# EAGLE design soil_moisture_meter (EAGLE 6.4)
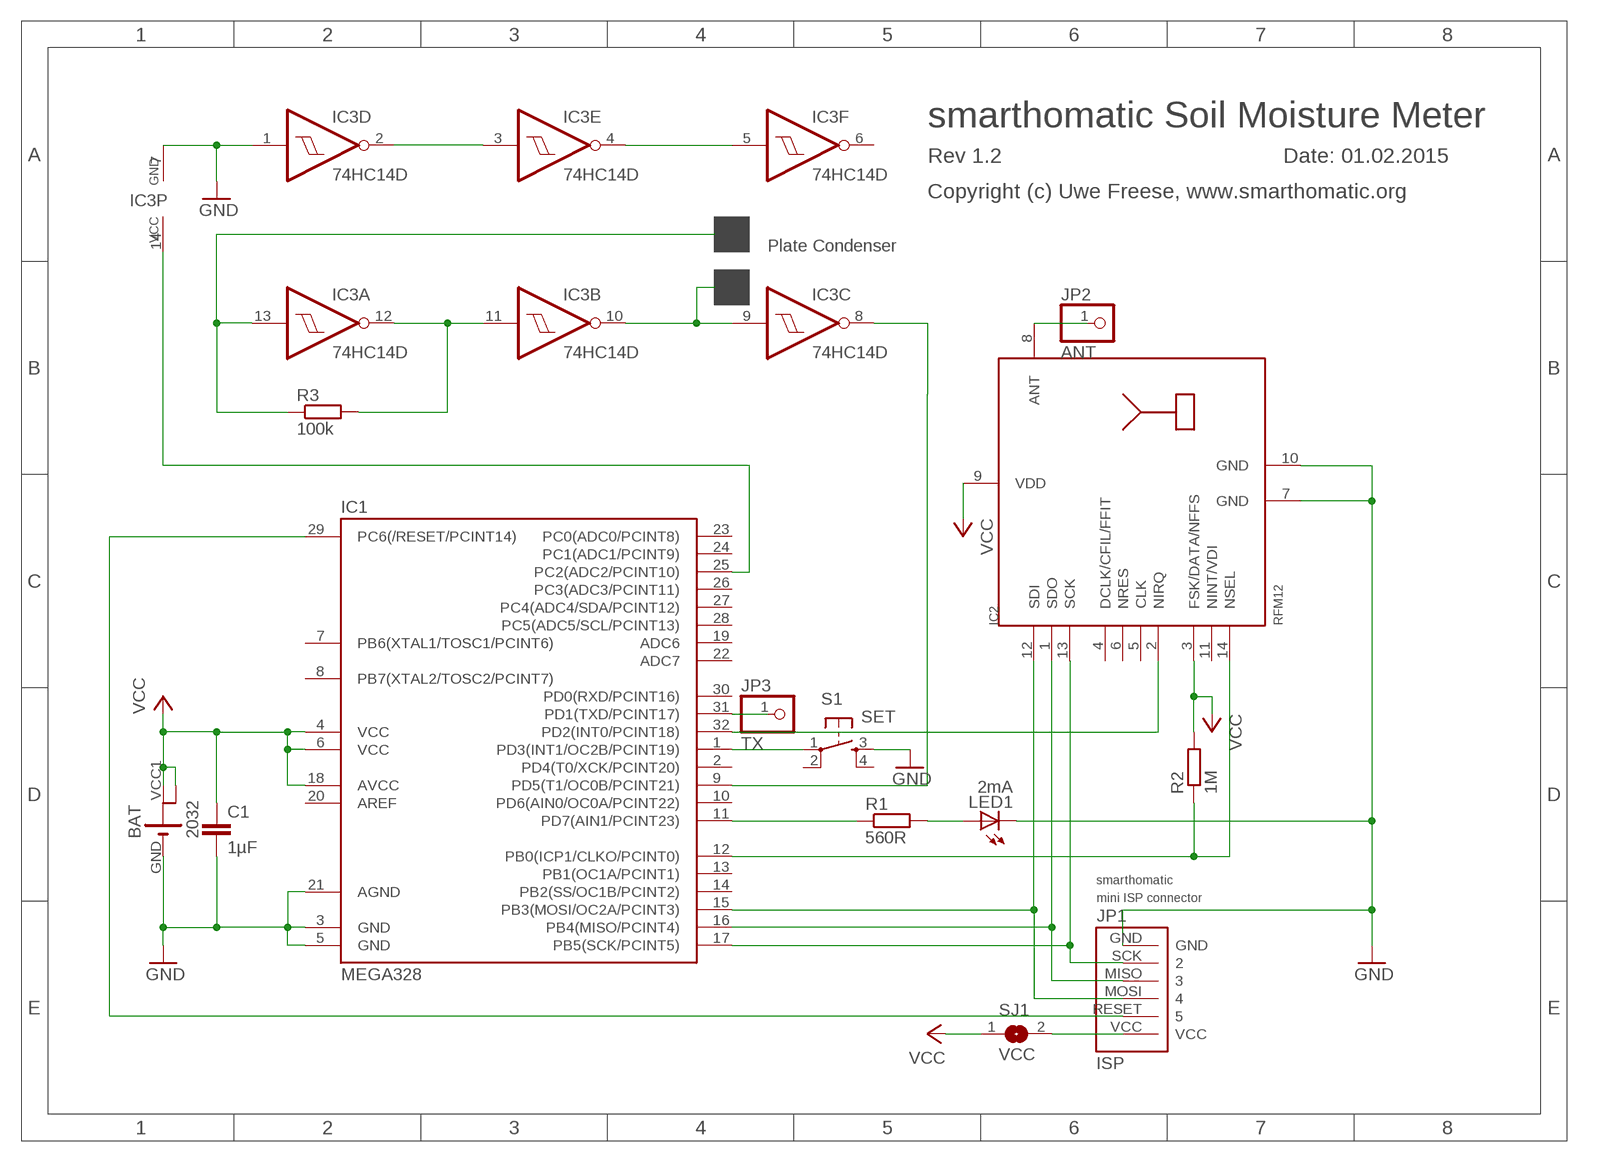
[diagram p0: schematic, sheet 1]

## Parts
BAT  2032  [KZH20SMD]
C1  1µF  C-EUC0603  [C0603]
IC1  MEGA328  MEGA48/88/168-AU  [TQFP32-08]
IC2  RFM12  [RFM]
IC3  74HC14D  [SO14]
JP1  ISP  SHC_MINI_ISPP  [PINHD_1X6_1.27]
JP2  ANT  PINHD-1X1  [1X01]
JP3  TX  PINHD-1X1  [1X01]
LED1  2mA  LED3MM  [LED3MM]
R1  560R  R-EU_R0603  [R0603]
R2  1M  R-EU_R0603  [R0603]
R3  100k  R-EU_R0603  [R0603]
S1  SET  LSG  [SCHURTER_LSG]
SJ1  VCC  SJ  [SJ]

## Nets
GND: BAT.GND C1.2 IC1.3(GND) IC1.5(GND) IC1.21(AGND) IC2.7(GND) IC2.10(GND) IC3.1(D:I) IC3.7(P:GND) JP1.GND LED1.K(C) S1.3(S)
N$1: JP1.VCC SJ1.2
N$2: IC3.11(B:I) IC3.12(A:O) R3.2
N$3: IC1.15(PB3(MOSI/OC2A/PCINT3)) IC2.12(SDI) JP1.MOSI
N$4: IC1.16(PB4(MISO/PCINT4)) IC2.1(SDO) JP1.MISO
N$5: IC1.17(PB5(SCK/PCINT5)) IC2.13(SCK) JP1.SCK
N$6: IC1.11(PD7(AIN1/PCINT23)) R1.1
N$7: IC3.9(C:I) IC3.10(B:O)
N$8: IC1.29(PC6(/RESET/PCINT14)) JP1.RESET
N$9: IC3.13(A:I) R3.1
N$10: IC1.9(PD5(T1/OC0B/PCINT21)) IC3.8(C:O)
N$12: LED1.A R1.2
N$13: IC1.12(PB0(ICP1/CLKO/PCINT0)) IC2.14(NSEL) R2.1
N$15: IC1.32(PD2(INT0/PCINT18)) IC2.2(NIRQ)
N$16: IC2.8(ANT) JP2.1
N$17: IC3.4(E:O) IC3.5(F:I)
N$18: IC3.2(D:O) IC3.3(E:I)
N$19: IC1.1(PD3(INT1/OC2B/PCINT19)) S1.1(P)
N$20: IC1.25(PC2(ADC2/PCINT10)) IC3.14(P:VCC)
N$21: IC1.31(PD1(TXD/PCINT17)) JP3.1
VCC: BAT.VCC1 BAT.VCC2 C1.1 IC1.4(VCC) IC1.6(VCC) IC1.18(AVCC) IC2.3(FSK/DATA/NFFS) IC2.9(VDD) R2.2 SJ1.1
Unconnected: IC1.2(PD4(T0/XCK/PCINT20)) IC1.7(PB6(XTAL1/TOSC1/PCINT6)) IC1.8(PB7(XTAL2/TOSC2/PCINT7)) IC1.10(PD6(AIN0/OC0A/PCINT22)) IC1.13(PB1(OC1A/PCINT1)) IC1.14(PB2(SS/OC1B/PCINT2)) IC1.19(ADC6) IC1.20(AREF) IC1.22(ADC7) IC1.23(PC0(ADC0/PCINT8)) IC1.24(PC1(ADC1/PCINT9)) IC1.26(PC3(ADC3/PCINT11)) IC1.27(PC4(ADC4/SDA/PCINT12)) IC1.28(PC5(ADC5/SCL/PCINT13)) IC1.30(PD0(RXD/PCINT16)) IC2.4(DCLK/CFIL/FFIT) IC2.5(CLK) IC2.6(NRES) IC2.11(NINT/VDI) IC3.6(F:O) S1.2(P1) S1.4(S1)

## Notes on the sheet
- smarthomatic Soil Moisture Meter
- Rev 1.2 | Date: 01.02.2015
- Copyright (c) Uwe Freese, www.smarthomatic.org
- Plate Condenser

## Library data of the parts
BAT = battery_holder_2032:2032
C1 = resistor:C-EU: CAPACITOR, European symbol
IC1 = avr-5-4.16:MEGA48/88/168
IC2 = hopeRF:RFM12
IC3 = 74xx-eu:74*14: Hex schmitt trigger INVERTER
JP1 = shc_mini_isp:SHC_MINI_ISP: smarthomatic mini ISP connector, 1.27mm grid
JP2 JP3 = pinhead:PINHD-1X1: PIN HEADER
LED1 = led:LED: LED OSRAM: - CHIPLED LG R971, LG N971, LY N971, LG Q971, LY Q971, LO R971, LY R971 LH N974, LH R974 LS Q976, LO Q976, LY Q976 LO Q996 - Hyper CHIPLED LW Q18S LB Q993, LB Q99A, LB R99A - SideLED LS A670, LO A670, LY A670, LG A670, LP A670 LB A673, LV A673, LT A673, LW A673 LH A674 LY A675 LS A676, LA A676, LO A676, LY A676, LW A676 LS A679, LY A679, LG A679 - Hyper Micro SIDELED® LS Y876, LA Y876, LO Y876, LY Y876 LT Y87S - SmartLED LW L88C, LW L88S LB L89C, LB L89S, LG L890 LS L89K, LO L89K, LY L89K LS L896, LA L896, LO L896, LY L896 - TOPLED LS T670, LO T670, LY T670, LG T670, LP T670 LSG T670, LSP T670, LSY T670, LOP T670, LYG T670 LG T671, LOG T671, LSG T671 LB T673, LV T673, LT T673, LW T673 LH T674 LS T676, LA T676, LO T676, LY T676, LB T676, LH T676, LSB T676, LW T676 LB T67C, LV T67C, LT T67C, LS T67K, LO T67K, LY T67K, LW E67C LS E67B, LA E67B, LO E67B, LY E67B, LB E67C, LV E67C, LT E67C LW T67C LS T679, LY T679, LG T679 LS T770, LO T770, LY T770, LG T770, LP T770 LB T773, LV T773, LT T773, LW T773 LH T774 LS E675, LA E675, LY E675, LS T675 LS T776, LA T776, LO T776, LY T776, LB T776 LHGB T686 LT T68C, LB T68C - Hyper Mini TOPLED® LB M676 - Mini TOPLED Santana® LG M470 LS M47K, LO M47K, LY M47K Source: http://www.osram.convergy.de LUXEON: - LUMILED® LXK2-PW12-R00, LXK2-PW12-S00, LXK2-PW14-U00, LXK2-PW14-V00 LXK2-PM12-R00, LXK2-PM12-S00, LXK2-PM14-U00 LXK2-PE12-Q00, LXK2-PE12-R00, LXK2-PE12-S00, LXK2-PE14-T00, LXK2-PE14-U00 LXK2-PB12-K00, LXK2-PB12-L00, LXK2-PB12-M00, LXK2-PB14-N00, LXK2-PB14-P00, LXK2-PB14-Q00 LXK2-PR12-L00, LXK2-PR12-M00, LXK2-PR14-Q00, LXK2-PR14-R00 LXK2-PD12-Q00, LXK2-PD12-R00, LXK2-PD12-S00 LXK2-PH12-R00, LXK2-PH12-S00 LXK2-PL12-P00, LXK2-PL12-Q00, LXK2-PL12-R00 Source: www.luxeon.com KINGBRIGHT: KA-3528ASYC Source: www.kingbright.com
R1-R3 = rcl:R-EU_: RESISTOR, European symbol
S1 = switch-omron-smd:LSG
SJ1 = jumper:SJ: SMD solder JUMPER

## Board
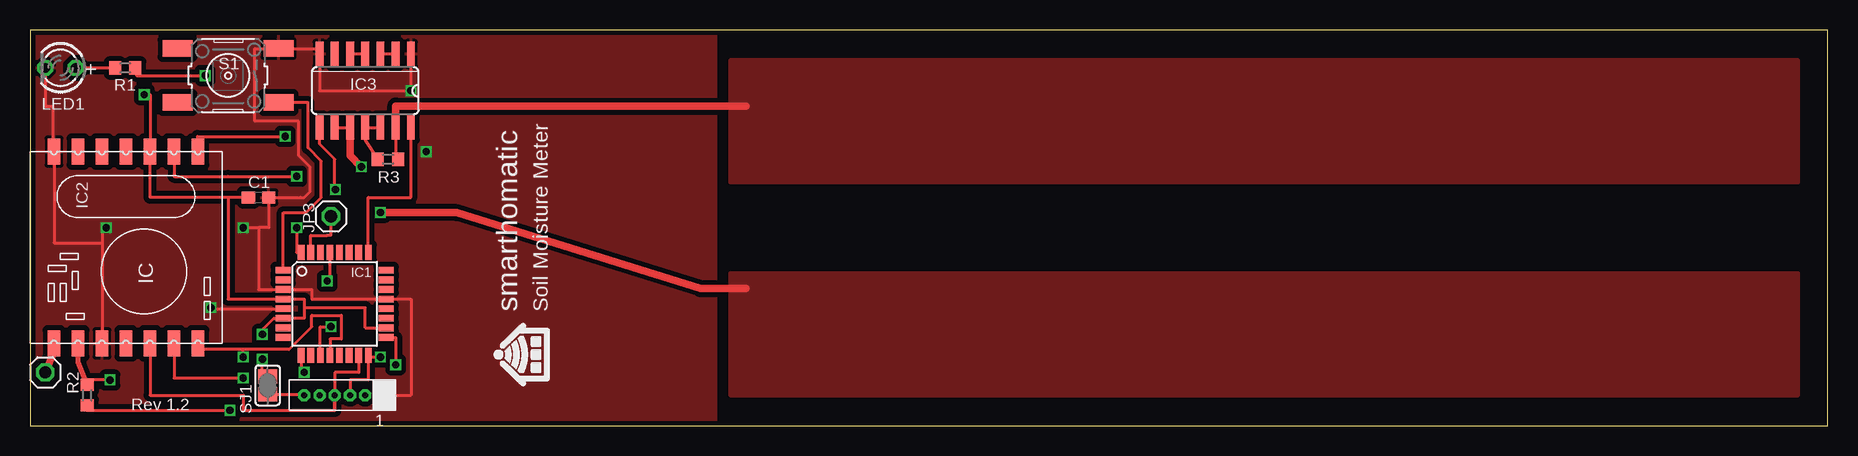
[diagram p1: board, top side]
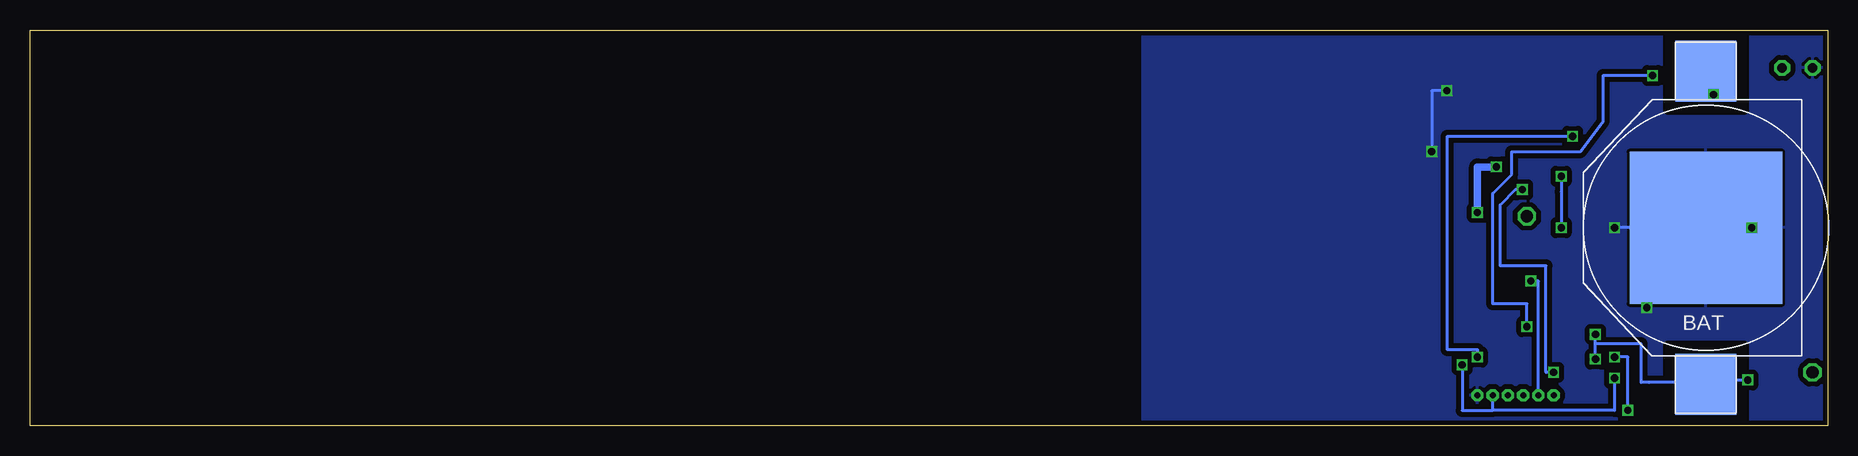
[diagram p2: board, bottom side, seen from below]

Size 149.86 x 33.01 mm. Coordinates in mm from the lower left corner, seen from the top.
Outline: 0,0 149.86,0 149.86,33.01 0,33.01 0,0
Copper layers (1*16): Top 0.035mm / dielectric 1.5mm / Bottom 0.035mm
Design rules "SeeedStudio_2layer_DRU_no_angle_20140221": minimum track width 6mil, minimum drill 12mil, track to track 6mil, track to pad 6mil, pad to pad 6mil, via to via 6mil, smd to smd 0mil, copper to edge 10mil, drill to drill 10mil, minimum pad ring 10mil, minimum via ring 6mil, stop-mask expansion 2mil, vias tented up to drill 100mil, thermal gap 10mil

### Footprints (pad centres in the part's own frame; a part is rotated, then mirrored left to right if it is on the bottom)
KZH20SMD = smd 12.7 x 12.7: GND 0,0 | smd 5.08 x 5.08: VCC1 -13.062,0; VCC2 13.062,0
C0603 = smd 1.1 x 1: 1 -0.85,0; 2 0.85,0
TQFP32-08 = smd 1.27 x 0.559: 1 -4.293,2.8; 2 -4.293,2; 3 -4.293,1.2; 4 -4.293,0.4; 5 -4.293,-0.4; 6 -4.293,-1.2; 7 -4.293,-2; 8 -4.293,-2.8; 17 4.293,-2.8; 18 4.293,-2; 19 4.293,-1.2; 20 4.293,-0.4; 21 4.293,0.4; 22 4.293,1.2; 23 4.293,2; 24 4.293,2.8 | smd 0.559 x 1.27: 9 -2.8,-4.293; 10 -2,-4.293; 11 -1.2,-4.293; 12 -0.4,-4.293; 13 0.4,-4.293; 14 1.2,-4.293; 15 2,-4.293; 16 2.8,-4.293; 25 2.8,4.293; 26 2,4.293; 27 1.2,4.293; 28 0.4,4.293; 29 -0.4,4.293; 30 -1.2,4.293; 31 -2,4.293; 32 -2.8,4.293
RFM = smd 2.184 x 1.067: 1 0,14; 2 0,12; 3 0,10; 4 0,8; 5 0,6; 6 0,4; 7 0,2; 8 16,2; 9 16,4; 10 16,6; 11 16,8; 12 16,10; 13 16,12; 14 16,14
SO14 = smd 0.66 x 2.032: 1 -3.81,-3.073; 2 -2.54,-3.073; 3 -1.27,-3.073; 4 0,-3.073; 5 1.27,-3.073; 6 2.54,-3.073; 7 3.81,-3.073; 8 3.81,3.073; 9 2.54,3.073; 10 1.27,3.073; 11 0,3.073; 12 -1.27,3.073; 13 -2.54,3.073; 14 -3.81,3.073
PINHD_1X6_1.27 = drill 0.5 octagon: GND 0,-2.54; MISO 0,0; MOSI 0,1.27; RESET 0,2.54; SCK 0,-1.27; VCC 0,3.81
1X01 = drill 1.016 octagon: 1 0,0
LED3MM = drill 0.813 octagon: A -1.27,0; K 1.27,0
R0603 = smd 1 x 1.1: 1 -0.85,0; 2 0.85,0
SCHURTER_LSG = smd 2.5 x 1.4: 1 -4.2,2.25; 2 4.2,2.25; 3 -4.2,-2.25; 4 4.2,-2.25
SJ = smd 1.168 x 1.6: 1 -0.762,0; 2 0.762,0

### Placement (x,y rotation side)
BAT  10.16,16.51 90 bottom
C1  19.05,19.05 0 top
IC1  25.4,10.16 0 top
IC2  0,22.86 270 top
IC3  27.94,27.94 180 top
JP1  26.67,2.54 90 top
JP2  1.27,4.45 0 top
JP3  25.08,17.46 0 top
LED1  2.54,29.84 180 top
R1  7.94,29.84 180 top
R2  4.76,2.54 90 top
R3  29.84,22.23 180 top
S1  16.51,29.21 180 top
SJ1  19.81,3.36 270 top

### Tracks (layer width: path | path; a pad name or v marks a point on that pad's centre or on a via)
GND  (via drill 0.6, 0.6 pad 0.61)
  Top 0.254: LED1.K 1.27,26.67 1.91,26.67 1.91,24.13 IC2.7 2,15.24 6,15.24 | IC1.21 23.5,10.56 23.5,11.36 IC1.3 19.05,11.36 19.05,16.51 | IC1.21 29.69,10.58 | JP1.GND 31.75,2.54 31.75,10.56 IC1.21 | IC3.1 v31.75,27.94 24.13,27.94 IC3.7 24.13,31.46 S1.3 18.73,31.46 18.73,25.4 22.38,25.4 22.38,22.54 23.34,21.59 23.34,21.43 23.34,19.53 22.86,19.05 22.54,19.05 C1.2 19.9,16.51 19.05,16.51 | 6,15.24 IC2.10 | v6.35,16.51 6,16.51 6,15.24 | v17.78,16.51 19.05,16.51 | v15.08,9.84 15.08,9.76 IC1.5
  Bottom 0.254: v6.35,16.51 BAT.GND 15.08,16.51 | 15.08,16.51 16.51,16.51 | 16.51,16.51 v17.78,16.51 | v15.08,9.84 15.08,16.51 | 15.08,16.51 16.51,16.51 | v31.75,27.94 33.02,27.94 v33.02,22.86
  pour Top (isolate 0.406): -0.32,33.34 57.15,33.34 57.15,-0.32 -0.32,-0.32
  pour Bottom (isolate 0.406): -0.64,33.66 57.15,33.66 57.15,-0.64 -0.64,-0.64
N$1
  Top 0.254: SJ1.2 22.8,2.6 JP1.VCC
N$2
  Top 0.254: R3.2 27.94,23.81 IC3.11 IC3.12
N$3
  Top 0.254: IC1.15 27.4,4.45 25.4,4.45 25.4,1.27 | 25.4,1.27 JP1.MOSI | IC2.12 10,2.54 17.78,2.54 17.78,1.27 25.4,1.27
N$4  (via drill 0.6)
  Top 0.254: JP1.MISO 26.67,3.81 28.2,3.81 IC1.16 28.2,5.71 v29.21,5.71 | IC2.1 arc-90 13.97,22.89 13.97,24.13 v21.27,24.13
  Bottom 0.254: v21.27,24.13 31.75,24.13 31.75,6.35 29.21,6.35 v29.21,5.71
N$5  (via drill 0.6)
  Top 0.254: IC1.17 30.48,7.36 v30.48,5.08 | IC2.13 12,3.97 v17.78,3.97
  Bottom 0.254: v30.48,5.08 30.48,1.27 27.94,1.27 | 27.94,1.27 JP1.SCK | v17.78,3.97 17.78,1.27 27.94,1.27
N$6  (via drill 0.6)
  Top 0.254: R1.1 8.89,29.21 v14.61,29.21 | IC1.11 24.2,8.26 v25.08,8.26
  Bottom 0.254: v14.61,29.21 18.73,29.21 18.73,25.4 20.64,22.86 26.35,22.86 26.35,20.95 27.94,19.37 27.94,10.16 25.08,10.16 v25.08,8.26
N$7  (via drill 0.6)
  Top 0.254: IC3.9 IC3.10
  Top 0.61: v29.21,17.78 35.56,17.78 55.88,11.43 59.69,11.43 | v27.62,21.59 26.67,22.54 IC3.10
  Bottom 0.61: v29.21,17.78 29.21,21.59 v27.62,21.59
  pour Top: 58.42,12.7 147.32,12.7 147.32,2.54 58.42,2.54
N$8  (via drill 0.6)
  Top 0.254: v24.77,12.06 25,12.06 IC1.29
  Bottom 0.254: JP1.RESET 24.13,12.06 v24.77,12.06
N$9
  Top 0.254: IC3.13 30.48,22.23 R3.1
  Top 0.61: IC3.13 30.48,26.67 59.69,26.67
  pour Top: 58.42,30.48 147.32,30.48 147.32,20.32 58.42,20.32
N$10  (via drill 0.6)
  Top 0.254: IC1.9 22.6,4.45 v22.86,4.45 | v25.46,19.68 25.4,19.68 25.4,22.23 24.13,23.5 IC3.8
  Bottom 0.254: v22.86,4.45 23.5,4.45 23.5,13.34 27.3,13.34 27.3,18.41 26.04,19.68 v25.46,19.68
N$12
  Top 0.254: LED1.A R1.2
N$13  (via drill 0.6)
  Top 0.254: IC2.14 14,6.35 17.78,6.35 | R2.1 4.76,1.27 v16.67,1.27 | IC1.12 25,7.22 25.95,7.22 25.95,9.21 23.5,9.21 23.5,8.26 21.59,6.35 17.78,6.35 | v17.78,5.72 17.78,6.35
  Bottom 0.254: v16.67,1.27 16.67,5.72 v17.78,5.72
N$15  (via drill 0.6)
  Top 0.254: IC2.2 12,20.8 16.51,20.8 v22.23,20.8 | v22.23,16.51 22.23,14.45 IC1.32
  Bottom 0.254: v22.23,20.8 22.23,19.53 v22.23,16.51
N$16
  Top 0.406: 1.91,5.91 IC2.8
  Top 0.61: JP2.1 1.91,5.91
N$17
  Top 0.254: IC3.5 IC3.4
N$18
  Top 0.254: IC3.3 IC3.2
N$19
  Top 0.254: IC1.1 21.11,17.78 23.02,17.78 24.29,19.05 24.29,22.07 23.18,23.18 23.18,26.96 S1.1
N$20
  Top 0.254: IC1.25 28.2,19.05 31.75,19.05 IC3.14
N$21
  Top 0.254: IC1.31 23.4,15.88 24.77,15.88 25.08,15.88 JP3.1
VCC  (via drill 0.6)
  Top 0.254: 22.86,9.84 22.86,10.56 IC1.4 16.51,10.56 16.51,19.05 | 22.86,9.84 22.86,8.96 IC1.6 20.32,8.96 19.34,7.98 19.37,7.85 v19.37,7.62 | IC1.18 27.94,8.16 27.94,9.84 22.86,9.84 | C1.1 16.51,19.05 | 16.51,19.05 10,19.05 IC2.3 10,27.62 v9.53,27.62 | v6.67,3.81 4.76,3.81 R2.2 | 19.83,3.68 19.81,3.84 SJ1.1 19.68,4.12 19.37,4.12 19.37,4.29 v19.37,5.56
  Top 0.406: R2.2 4,5.29 IC2.9
  Bottom 0.254: BAT.VCC2 v9.53,27.62 | v6.67,3.81 10.16,3.81 10.16,5.08 BAT.VCC1 10.16,3.49 10.16,3.61 14.92,3.61 15.56,3.61 15.56,6.83 19.37,6.83 | v19.37,5.56 19.37,6.83 | 19.37,6.83 v19.37,7.62

### Text on the board
tNames: + | smarthomatic | Soil Moisture Meter | Rev 1.2
bValues: + | GND | +